# EAGLE design mLRS-tx-module01-v014 (EAGLE 7.5.0)
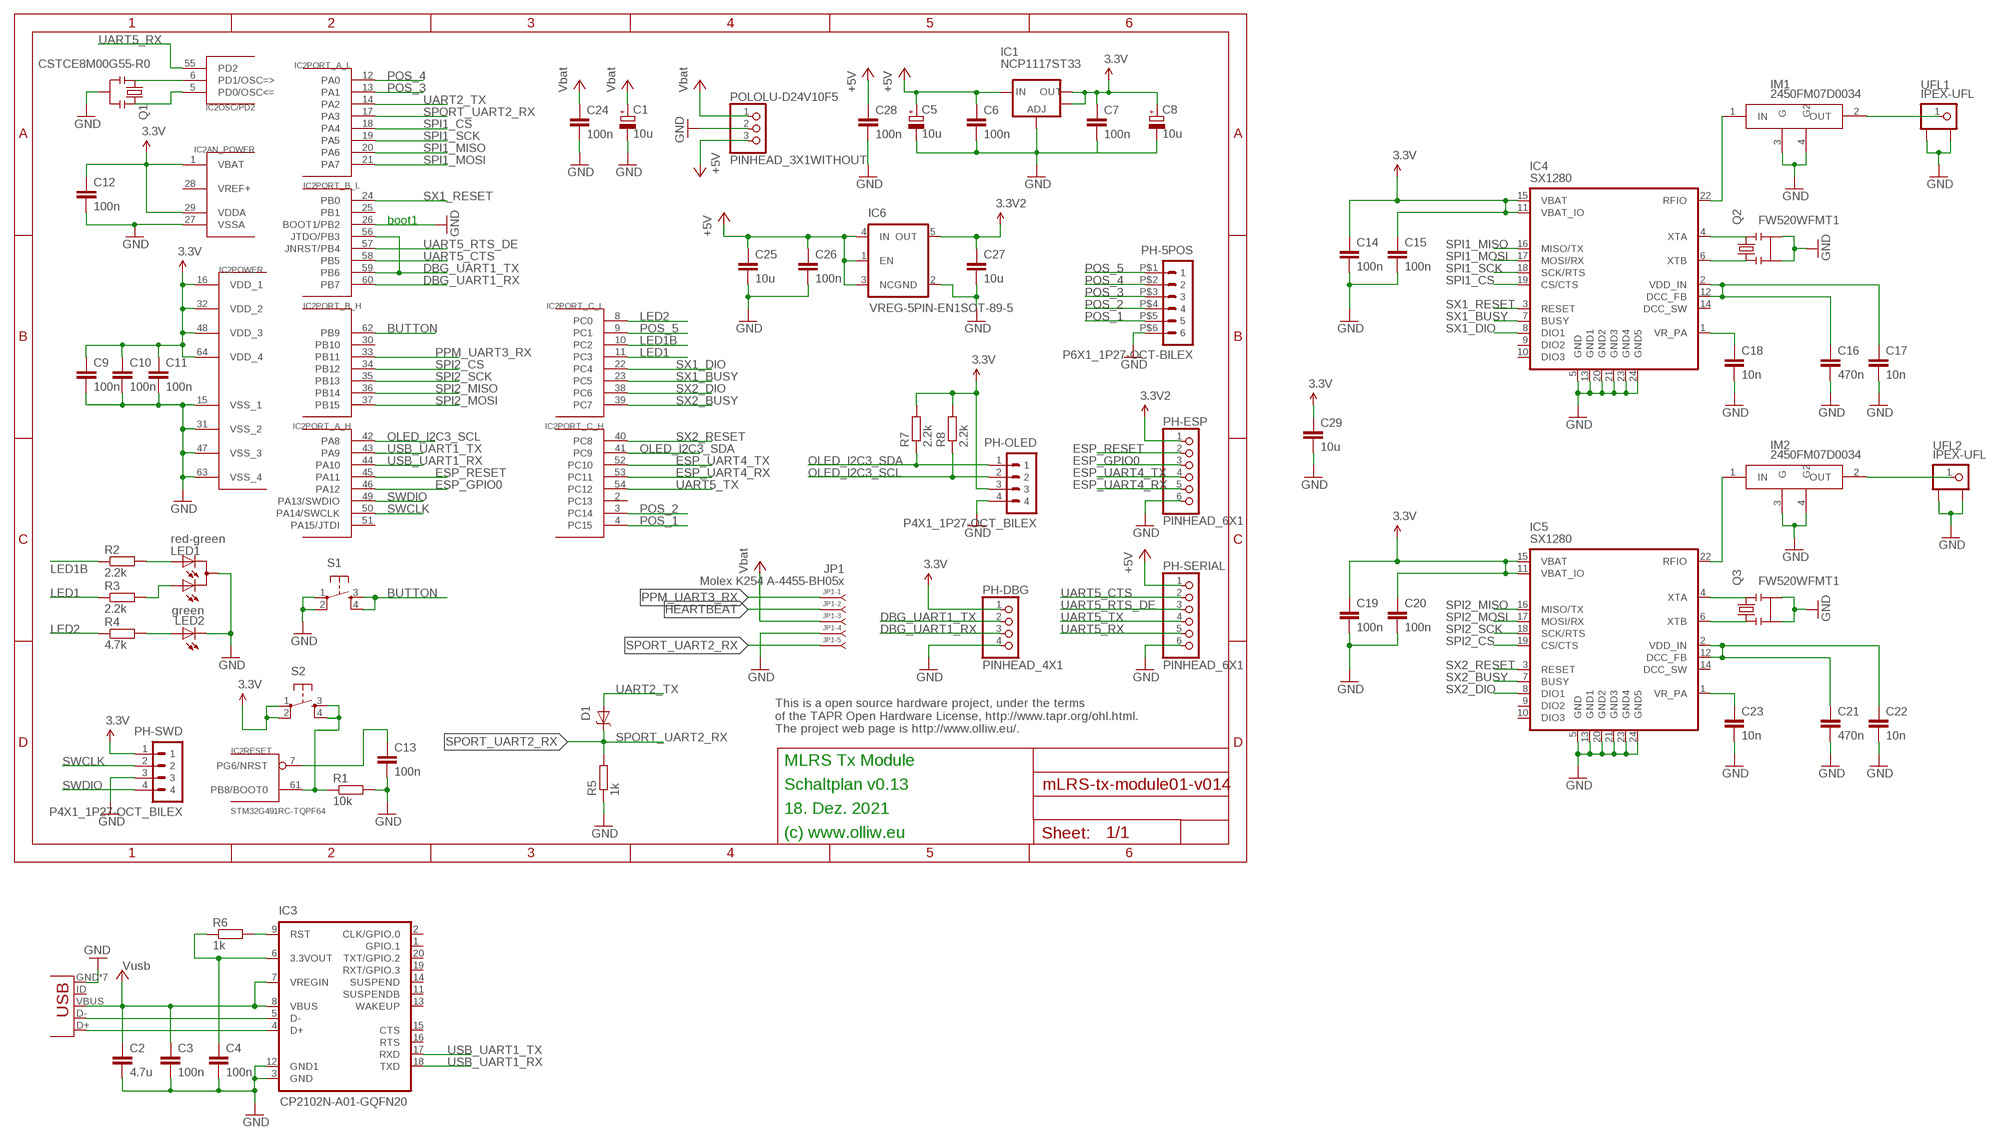
[diagram p0: schematic, sheet 1]

## Parts
C1  10u  CPOL-EUSMCA  [SMC_A]
C2  4.7u  C-EUC0603  [C0603]
C3  100n  C-EUC0402  [C0402]
C4  100n  C-EUC0402  [C0402]
C5  10u  CPOL-EUSMCA  [SMC_A]
C6  100n  C-EUC0603  [C0603]
C7  100n  C-EUC0603  [C0603]
C8  10u  CPOL-EUSMCA  [SMC_A]
C9  100n  C-EUC0603  [C0603]
C10  100n  C-EUC0603  [C0603]
C11  100n  C-EUC0603  [C0603]
C12  100n  C-EUC0603  [C0603]
C13  100n  C-EUC0603  [C0603]
C14  100n  C-EUC0402  [C0402]
C15  100n  C-EUC0402  [C0402]
C16  470n  C-EUC0402  [C0402]
C17  10n  C-EUC0402  [C0402]
C18  10n  C-EUC0402  [C0402]
C19  100n  C-EUC0402  [C0402]
C20  100n  C-EUC0402  [C0402]
C21  470n  C-EUC0402  [C0402]
C22  10n  C-EUC0402  [C0402]
C23  10n  C-EUC0402  [C0402]
C24  100n  C-EUC0603  [C0603]
C25  10u  C-EUC0603  [C0603]
C26  100n  C-EUC0603  [C0603]
C27  10u  C-EUC0603  [C0603]
C28  100n  C-EUC0603  [C0603]
C29  10u  C-EUC0603  [C0603]
D1  PMEG3010ER  DIODE-SCHOTTKYSOD123-W  [SOD123W-DIODE]
IC1  NCP1117ST33  V_REG_LM1117SOT223  [SOT223]
IC2  STM32G491RC-TQPF64  STM32G4X1RX-TQPF64  [TQFP64]
IC3  CP2102N-A01-GQFN20  CP2102N-QFN20  [QFN20-CP2102N]
IC4  SX1280  [QFN24-4X4-SX128X]
IC5  SX1280  [QFN24-4X4-SX128X]
IC6  VREG-5PIN-EN1SOT-89-5  [SOT-89-5]
IM1  2450FM07D0034  SX-IMPEDANCE-MATCH  [SX-IMPEDANCE-MATCH]
IM2  2450FM07D0034  SX-IMPEDANCE-MATCH  [SX-IMPEDANCE-MATCH]
JP1  Molex K254 A-4455-BH05x  4455-B05_S  [4455-B05]
LED1  red-green  LED-DUO-C-TIGHT  [LED-DUO-TIGHT]
LED2  green  LED3MM  [LED3MM]
PH-5POS  P6X1_1P27-OCT-BILEX  [6X1_1P27_OCT_BILEX]
PH-DBG  PINHEAD_4X1  [PINHEAD_4X1]
PH-ESP  PINHEAD_6X1  [PINHEAD_6X1]
PH-OLED  P4X1_1P27-OCT_BILEX  [4X1_1P27_OCT_BILEX]
PH-SERIAL  PINHEAD_6X1  [PINHEAD_6X1]
PH-SWD  P4X1_1P27-OCT_BILEX  [4X1_1P27_OCT_BILEX]
POLOLU-D24V10F5  PINHEAD_3X1WITHOUT  [PINHEAD_3X1_WO]
Q1  CSTCE8M00G55-R0  RESONATORSMD  [RESONATOR-SMD]
Q2  FW520WFMT1  CRYSTAL52MHZ  [CRYSTAL-SMD-2X1P6-GND]
Q3  FW520WFMT1  CRYSTAL52MHZ  [CRYSTAL-SMD-2X1P6-GND]
R1  10k  R-EU_R0402  [R0402]
R2  2.2k  R-EU_R0402  [R0402]
R3  2.2k  R-EU_R0402  [R0402]
R4  4.7k  R-EU_R0402  [R0402]
R5  1k  R-EU_R0402  [R0402]
R6  1k  R-EU_R0402  [R0402]
R7  2.2k  R-EU_R0402  [R0402]
R8  2.2k  R-EU_R0402  [R0402]
S1  TAC_SWITCHPTH  [TACTILE-PTH]
S2  TAC_SWITCHPTH  [TACTILE-PTH]
UFL1  IPEX-UFL  [IPEX-UFL-SMD]
UFL2  IPEX-UFL  [IPEX-UFL-SMD]
USB  USB-MICROB-UP  [USB-MICROB-UP]

## Nets
2.8V: C27.1 IC6.5(OUT) PH-ESP.1 ; supply symbol labelled 3.3V2
3.3V: C7.1 C8.+ C9.1 C10.1 C11.1 C12.1 C14.1 C15.1 C19.1 C20.1 C29.1 IC1.2(OUT) IC1.4(OUT) IC2.1(AN_POWER:VBAT) IC2.16(POWER:VDD_1) IC2.29(AN_POWER:VDDA) IC2.32(POWER:VDD_2) IC2.48(POWER:VDD_3) IC2.64(POWER:VDD_4) IC4.11(VBAT_IO) IC4.15(VBAT) IC5.11(VBAT_IO) IC5.15(VBAT) PH-DBG.1 PH-OLED.3 PH-SWD.1 R7.2 R8.2 S2.1 S2.2
3.3V-CP2102: C4.1 IC3.6(3.3VOUT) R6.1
+5V: C5.+ C6.1 C25.1 C26.1 C28.1 IC1.3(IN) IC6.1(EN) IC6.3(NC) IC6.4(IN) PH-SERIAL.1 POLOLU-D24V10F5.3
BOOT0: IC2.61(RESET:PB8/BOOT0) R1.1 S2.3 S2.4
BUTTON: IC2.62(PORT_B_H:PB9) S1.3 S1.4
DBG_UART1_RX: IC2.60(PORT_B_L:PB7) PH-DBG.3
DBG_UART1_TX: IC2.56(PORT_B_L:JTDO/PB3) IC2.59(PORT_B_L:PB6) PH-DBG.2
ESP_GPIO0: IC2.46(PORT_A_H:PA12) PH-ESP.3
ESP_RESET: IC2.45(PORT_A_H:PA11) PH-ESP.2
ESP_UART4_RX: IC2.53(PORT_C_H:PC11) PH-ESP.5
ESP_UART4_TX: IC2.52(PORT_C_H:PC10) PH-ESP.4
GND: C1.- C2.2 C3.2 C4.2 C5.- C6.2 C7.2 C8.- C9.2 C10.2 C11.2 C12.2 C13.2 C14.2 C15.2 C16.2 C17.2 C18.2 C19.2 C20.2 C21.2 C22.2 C23.2 C24.2 C25.2 C26.2 C27.2 C28.2 C29.2 IC1.1(ADJ) IC2.15(POWER:VSS_1) IC2.26(PORT_B_L:BOOT1/PB2) IC2.27(AN_POWER:VSSA) IC2.31(POWER:VSS_2) IC2.47(POWER:VSS_3) IC2.63(POWER:VSS_4) IC3.3(GND) IC3.12(GND1) IC4.5(GND) IC4.13(GND1) IC4.20(GND2) IC4.21(GND3) IC4.23(GND4) IC4.24(GND5) IC5.5(GND) IC5.13(GND1) IC5.20(GND2) IC5.21(GND3) IC5.23(GND4) IC5.24(GND5) IC6.2(GND) IM1.3(G) IM1.4(G2) IM2.3(G) IM2.4(G2) JP1.4 LED1.K(C) LED2.K(C) PH-5POS.P$6 PH-DBG.4 PH-ESP.6 PH-OLED.4 PH-SERIAL.6 PH-SWD.3 POLOLU-D24V10F5.2 Q1.2 Q2.2 Q2.4 Q3.2 Q3.4 R1.2 R5.1 S1.1 S1.2 UFL1.2 UFL1.3 UFL2.2 UFL2.3 USB.GND USB.P$1(GND) USB.P$2(GND) USB.P$3(GND) USB.P$4(GND) USB.P$5(GND) USB.P$6(GND)
HEARTBEAT: JP1.2
LED1: IC2.11(PORT_C_L:PC3) R3.1
LED1B: IC2.10(PORT_C_L:PC2) R2.1
LED2: IC2.8(PORT_C_L:PC0) R4.1
N$1: IC3.5(D-) USB.D-
N$2: C21.1 C22.1 IC5.2(VDD_IN) IC5.12(DCC_FB)
N$3: IC3.4(D+) USB.D+
N$4: LED1.A2 R2.2
N$5: C13.1 IC2.7(RESET:PG6/NRST)
N$6: C23.1 IC5.1(VR_PA)
N$7: IC5.4(XTA) Q3.3
N$8: LED1.A1 R3.2
N$9: LED2.A R4.2
N$10: IC5.6(XTB) Q3.1
N$11: IC5.22(RFIO) IM2.1(IN)
N$12: IC2.5(OSC/PD2:PD0/OSC<=) Q1.3
N$13: C16.1 C17.1 IC4.2(VDD_IN) IC4.12(DCC_FB)
N$14: IC2.6(OSC/PD2:PD1/OSC=>) Q1.1
N$15: C18.1 IC4.1(VR_PA)
N$16: IC4.4(XTA) Q2.3
N$17: IC4.6(XTB) Q2.1
N$18: IC4.22(RFIO) IM1.1(IN)
N$19: IM1.2(OUT) UFL1.1
N$20: IM2.2(OUT) UFL2.1
N$21: IC3.9(RST) R6.2
OLED_I2C3_SCL: IC2.42(PORT_A_H:PA8) PH-OLED.2 R8.1
OLED_I2C3_SDA: IC2.41(PORT_C_H:PC9) PH-OLED.1 R7.1
POS_1: IC2.4(PORT_C_H:PC15) PH-5POS.P$5
POS_2: IC2.3(PORT_C_H:PC14) PH-5POS.P$4
POS_3: IC2.13(PORT_A_L:PA1) PH-5POS.P$3
POS_4: IC2.12(PORT_A_L:PA0) PH-5POS.P$2
POS_5: IC2.9(PORT_C_L:PC1) PH-5POS.P$1
PPM_UART3_RX: IC2.33(PORT_B_H:PB11) JP1.1
SPI1_CS: IC2.18(PORT_A_L:PA4) IC4.19(CS/CTS)
SPI1_MISO: IC2.20(PORT_A_L:PA6) IC4.16(MISO/TX)
SPI1_MOSI: IC2.21(PORT_A_L:PA7) IC4.17(MOSI/RX)
SPI1_SCK: IC2.19(PORT_A_L:PA5) IC4.18(SCK/RTS)
SPI2_CS: IC2.34(PORT_B_H:PB12) IC5.19(CS/CTS)
SPI2_MISO: IC2.36(PORT_B_H:PB14) IC5.16(MISO/TX)
SPI2_MOSI: IC2.37(PORT_B_H:PB15) IC5.17(MOSI/RX)
SPI2_SCK: IC2.35(PORT_B_H:PB13) IC5.18(SCK/RTS)
SPORT_UART2_RX: D1.C IC2.17(PORT_A_L:PA3) JP1.5 R5.2
SWCLK: IC2.50(PORT_A_H:PA14/SWCLK) PH-SWD.2
SWDIO: IC2.49(PORT_A_H:PA13/SWDIO) PH-SWD.4
SX1_BUSY: IC2.23(PORT_C_L:PC5) IC4.7(BUSY)
SX1_DIO: IC2.22(PORT_C_L:PC4) IC4.8(DIO1)
SX1_RESET: IC2.24(PORT_B_L:PB0) IC4.3(RESET)
SX2_BUSY: IC2.39(PORT_C_L:PC7) IC5.7(BUSY)
SX2_DIO: IC2.38(PORT_C_L:PC6) IC5.8(DIO1)
SX2_RESET: IC2.40(PORT_C_H:PC8) IC5.3(RESET)
UART2_TX: D1.A IC2.14(PORT_A_L:PA2)
UART5_CTS: IC2.58(PORT_B_L:PB5) PH-SERIAL.2
UART5_RTS_DE: IC2.57(PORT_B_L:JNRST/PB4) PH-SERIAL.3
UART5_RX: IC2.55(OSC/PD2:PD2) PH-SERIAL.5
UART5_TX: IC2.54(PORT_C_H:PC12) PH-SERIAL.4
USB_UART1_RX: IC2.44(PORT_A_H:PA10) IC3.18(TXD)
USB_UART1_TX: IC2.43(PORT_A_H:PA9) IC3.17(RXD)
VCC: C1.+ C24.1 JP1.3 POLOLU-D24V10F5.1 ; supply symbol labelled Vbat
VUSB: C2.1 C3.1 IC3.7(VREGIN) IC3.8(VBUS) USB.VBUS ; supply symbol labelled Vusb
Unconnected: IC2.2(PORT_C_H:PC13) IC2.25(PORT_B_L:PB1) IC2.28(AN_POWER:VREF+) IC2.30(PORT_B_H:PB10) IC2.51(PORT_A_H:PA15/JTDI) IC3.1(GPIO.1) IC3.2(CLK/GPIO.0) IC3.11(SUSPENDB) IC3.13(WAKEUP) IC3.14(SUSPEND) IC3.15(CTS) IC3.16(RTS) IC3.19(RXT/GPIO.3) IC3.20(TXT/GPIO.2) IC4.9(DIO2) IC4.10(DIO3) IC4.14(DCC_SW) IC5.9(DIO2) IC5.10(DIO3) IC5.14(DCC_SW) USB.ID

## Notes on the sheet
- boot1
- This is a open source hardware project, under the terms
  of the TAPR Open Hardware License, http://www.tapr.org/ohl.html.
  The project web page is http://www.olliw.eu/.
- MLRS Tx Module
- Schaltplan v0.13
- 18. Dez. 2021
- (c) www.olliw.eu

## Library data of the parts
C1 C5 C8 = rcl:CPOL-EU: POLARIZED CAPACITOR, European symbol
C2-C4 C6 C7 C9-C29 = rcl:C-EU: CAPACITOR, European symbol
D1 = # stdlib:DIODE-SCHOTTKY
IC1 = # SparkFun2:V_REG_LM1117: Voltage Regulator LM1117 Standard adjustable voltage regulator but in SMD form. Spark Fun Electronics SKU : COM-00595
IC2 = # stm32:STM32G4X1RX
IC3 = # stdlib:CP2102N-QFN20
IC4 IC5 = # stdlib:SX1280
IC6 = # stdlib:VREG-5PIN-EN1
IM1 IM2 = # stdlib:SX-IMPEDANCE-MATCH
JP1 = con-molex-kk:4455-B05_S: RECEPTACAL
LED1 = # stdlib:LED-DUO-C
LED2 = led:LED: LED OSRAM: - CHIPLED LG R971, LG N971, LY N971, LG Q971, LY Q971, LO R971, LY R971 LH N974, LH R974 LS Q976, LO Q976, LY Q976 LO Q996 - Hyper CHIPLED LW Q18S LB Q993, LB Q99A, LB R99A - SideLED LS A670, LO A670, LY A670, LG A670, LP A670 LB A673, LV A673, LT A673, LW A673 LH A674 LY A675 LS A676, LA A676, LO A676, LY A676, LW A676 LS A679, LY A679, LG A679 - Hyper Micro SIDELED® LS Y876, LA Y876, LO Y876, LY Y876 LT Y87S - SmartLED LW L88C, LW L88S LB L89C, LB L89S, LG L890 LS L89K, LO L89K, LY L89K LS L896, LA L896, LO L896, LY L896 - TOPLED LS T670, LO T670, LY T670, LG T670, LP T670 LSG T670, LSP T670, LSY T670, LOP T670, LYG T670 LG T671, LOG T671, LSG T671 LB T673, LV T673, LT T673, LW T673 LH T674 LS T676, LA T676, LO T676, LY T676, LB T676, LH T676, LSB T676, LW T676 LB T67C, LV T67C, LT T67C, LS T67K, LO T67K, LY T67K, LW E67C LS E67B, LA E67B, LO E67B, LY E67B, LB E67C, LV E67C, LT E67C LW T67C LS T679, LY T679, LG T679 LS T770, LO T770, LY T770, LG T770, LP T770 LB T773, LV T773, LT T773, LW T773 LH T774 LS E675, LA E675, LY E675, LS T675 LS T776, LA T776, LO T776, LY T776, LB T776 LHGB T686 LT T68C, LB T68C - Hyper Mini TOPLED® LB M676 - Mini TOPLED Santana® LG M470 LS M47K, LO M47K, LY M47K Source: http://www.osram.convergy.de LUXEON: - LUMILED® LXK2-PW12-R00, LXK2-PW12-S00, LXK2-PW14-U00, LXK2-PW14-V00 LXK2-PM12-R00, LXK2-PM12-S00, LXK2-PM14-U00 LXK2-PE12-Q00, LXK2-PE12-R00, LXK2-PE12-S00, LXK2-PE14-T00, LXK2-PE14-U00 LXK2-PB12-K00, LXK2-PB12-L00, LXK2-PB12-M00, LXK2-PB14-N00, LXK2-PB14-P00, LXK2-PB14-Q00 LXK2-PR12-L00, LXK2-PR12-M00, LXK2-PR14-Q00, LXK2-PR14-R00 LXK2-PD12-Q00, LXK2-PD12-R00, LXK2-PD12-S00 LXK2-PH12-R00, LXK2-PH12-S00 LXK2-PL12-P00, LXK2-PL12-Q00, LXK2-PL12-R00 Source: www.luxeon.com KINGBRIGHT: KA-3528ASYC Source: www.kingbright.com
PH-5POS = # stdlib:P6X1_1P27: PinHead 6x1 1.27mm - QUAD 1.0x0.5 - QUAD 1.0x0.6 - LONG 1.0x0.5 - LONG 1.0x0.6
PH-DBG = # stdlib:PINHEAD_4X1
PH-ESP PH-SERIAL = # stdlib:PINHEAD_6X1
PH-OLED PH-SWD = # stdlib:P4X1_1P27
POLOLU-D24V10F5 = # stdlib:PINHEAD_3X1
Q1 = # SparkFun2:RESONATOR: Resonator Small SMD resonator. This is the itty bitty 10/20MHz resonators with built in caps. CSTCE10M0G55 and CSTCE20M0V53. Footprint has been reviewed closely but hasn't been tested yet.
Q2 Q3 = # stdlib:CRYSTAL52MHZ
R1-R8 = rcl:R-EU_: RESISTOR, European symbol
S1 S2 = # SparkFun2:TAC_SWITCH: Momentary Switch Button commonly used for reset or general input. Spark Fun Electronics SKU : COM-00097
UFL1 UFL2 = # stdlib:IPEX-UFL
USB = # stdlib:USB-MICROB

## Board
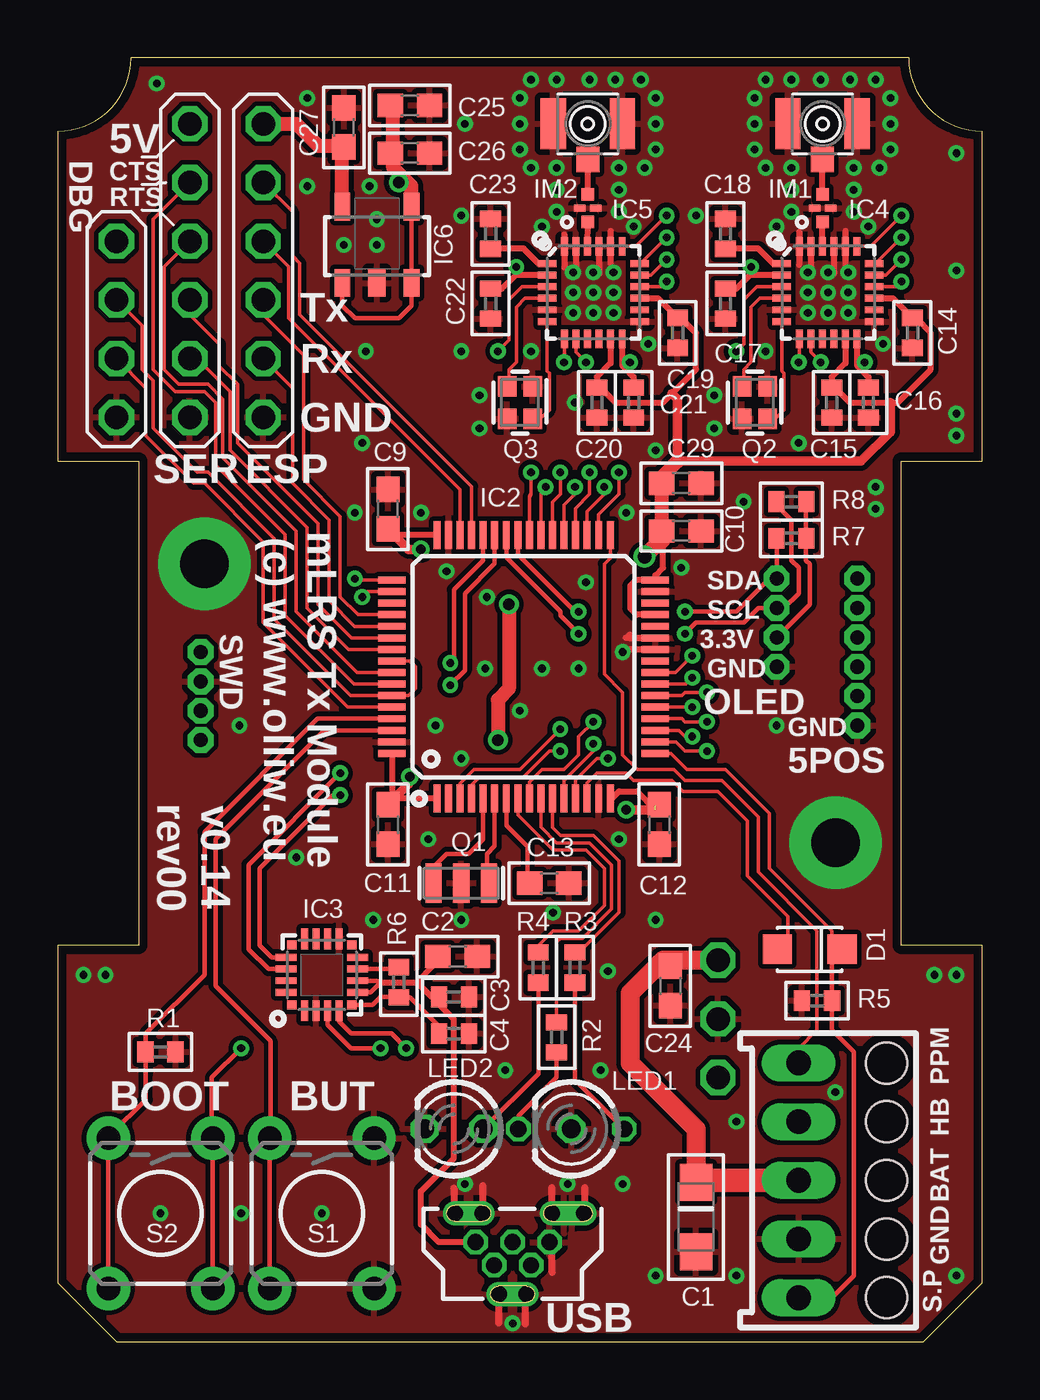
[diagram p1: board, top side]
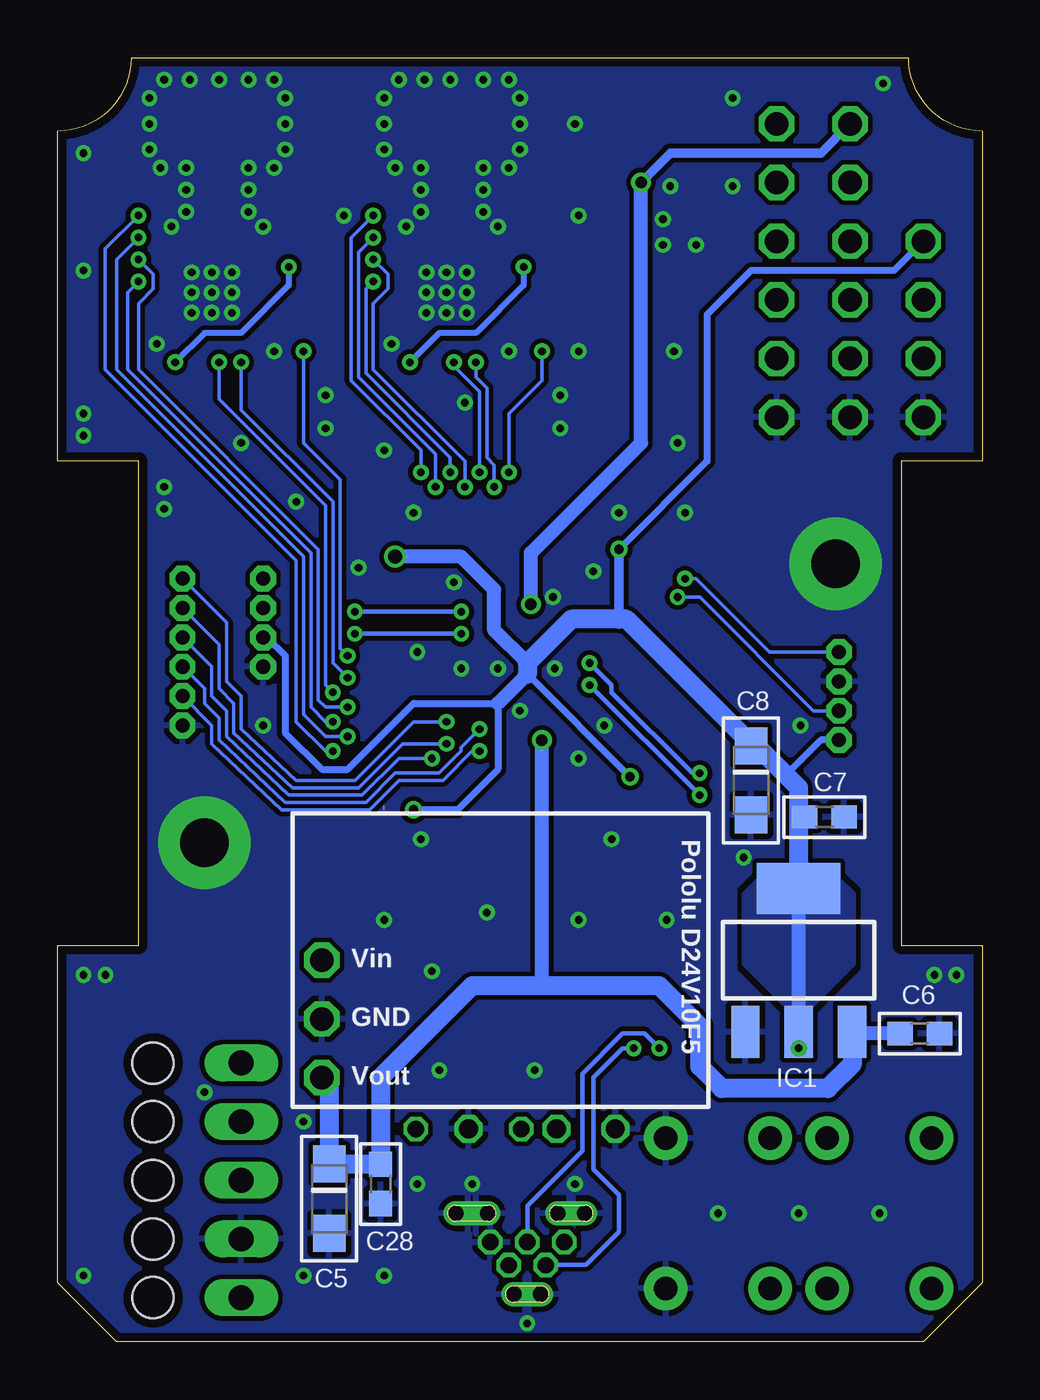
[diagram p2: board, bottom side, seen from below]

Size 40.01 x 55.56 mm. Coordinates in mm from the lower left corner, seen from the top.
Outline: 2.54,0 37.47,0 40.01,2.54 40.01,17.14 36.51,17.14 36.51,38.1 40.01,38.1 40.01,52.39 arc-90 36.83,55.56 3.17,55.56 arc-90 0,52.39 0,38.1 3.49,38.1 3.49,17.14 0,17.14 0,2.54 2.54,0
Copper layers (1*16): Top 0.0356mm / dielectric 1.5011mm / Bottom 0.0356mm
Design rules "ow-oshpark-2layer": minimum track width 6mil, minimum drill 13mil, track to track 6mil, track to pad 6mil, pad to pad 6mil, via to via 6mil, smd to smd 6mil, copper to edge 15mil, drill to drill 6mil, minimum pad ring 7mil, minimum via ring 7mil, stop-mask expansion 2.5mil, vias tented up to drill 26mil, thermal gap 10mil

### Footprints (pad centres in the part's own frame; a part is rotated, then mirrored left to right if it is on the bottom)
SMC_A = smd 1.6 x 1.4: + -1.5,0; - 1.5,0
C0603 = smd 1.1 x 1: 1 -0.85,0; 2 0.85,0
C0402 = smd 0.7 x 0.9: 1 -0.65,0; 2 0.65,0
SOD123W-DIODE = smd 1.27 x 1.27: A -1.4,0; C 1.4,0
SOT223 = smd 1.219 x 2.235: 1 -2.311,-3.099; 2 0,-3.099; 3 2.311,-3.099 | smd 3.6 x 2.2: 4 0,3.099
TQFP64 = smd 1.2 x 0.3: 1 -5.7,3.75; 2 -5.7,3.25; 3 -5.7,2.75; 4 -5.7,2.25; 5 -5.7,1.75; 6 -5.7,1.25; 7 -5.7,0.75; 8 -5.7,0.25; 9 -5.7,-0.25; 10 -5.7,-0.75; 11 -5.7,-1.25; 12 -5.7,-1.75; 13 -5.7,-2.25; 14 -5.7,-2.75; 15 -5.7,-3.25; 16 -5.7,-3.75; 33 5.7,-3.75; 34 5.7,-3.25; 35 5.7,-2.75; 36 5.7,-2.25; 37 5.7,-1.75; 38 5.7,-1.25; 39 5.7,-0.75; 40 5.7,-0.25; 41 5.7,0.25; 42 5.7,0.75; 43 5.7,1.25; 44 5.7,1.75; 45 5.7,2.25; 46 5.7,2.75; 47 5.7,3.25; 48 5.7,3.75 | smd 0.3 x 1.2: 17 -3.75,-5.7; 18 -3.25,-5.7; 19 -2.75,-5.7; 20 -2.25,-5.7; 21 -1.75,-5.7; 22 -1.25,-5.7; 23 -0.75,-5.7; 24 -0.25,-5.7; 25 0.25,-5.7; 26 0.75,-5.7; 27 1.25,-5.7; 28 1.75,-5.7; 29 2.25,-5.7; 30 2.75,-5.7; 31 3.25,-5.7; 32 3.75,-5.7; 49 3.75,5.7; 50 3.25,5.7; 51 2.75,5.7; 52 2.25,5.7; 53 1.75,5.7; 54 1.25,5.7; 55 0.75,5.7; 56 0.25,5.7; 57 -0.25,5.7; 58 -0.75,5.7; 59 -1.25,5.7; 60 -1.75,5.7; 61 -2.25,5.7; 62 -2.75,5.7; 63 -3.25,5.7; 64 -3.75,5.7
QFN20-CP2102N = smd 0.4 x 0.4: 1 -1.3,1.3; 6 -1.3,-1.3; 11 1.3,-1.3; 16 1.3,1.3 | smd 0.9 x 0.3: 2 -1.55,0.75; 3 -1.55,0.25; 4 -1.55,-0.25; 5 -1.55,-0.75; 12 1.55,-0.75; 13 1.55,-0.25; 14 1.55,0.25; 15 1.55,0.75 | smd 0.3 x 0.9: 7 -0.75,-1.55; 8 -0.25,-1.55; 9 0.25,-1.55; 10 0.75,-1.55; 17 0.75,1.55; 18 0.25,1.55; 19 -0.25,1.55; 20 -0.75,1.55
QFN24-4X4-SX128X = smd 0.8 x 0.3: 1 -2,1.25; 2 -2,0.75; 3 -2,0.25; 4 -2,-0.25; 5 -2,-0.75; 6 -2,-1.25; 13 2,-1.25; 14 2,-0.75; 15 2,-0.25; 16 2,0.25; 17 2,0.75; 18 2,1.25 | smd 0.3 x 0.8: 7 -1.25,-2; 8 -0.75,-2; 9 -0.25,-2; 10 0.25,-2; 11 0.75,-2; 12 1.25,-2; 19 1.25,2; 20 0.75,2; 21 0.25,2; 22 -0.25,2; 23 -0.75,2; 24 -1.25,2
SOT-89-5 = smd 0.68 x 1.2: 1 -1.5,-1.65; 3 1.5,-1.65; 4 1.5,1.65; 5 -1.5,1.65 | smd 0.76 x 1.2: 2 0,-1.65
SX-IMPEDANCE-MATCH = smd 0.55 x 0.55: 1 -0.6,0; 2 0.6,0 | smd 0.3 x 0.5: 3 0,-0.35; 4 0,0.35
4455-B05 = drill 1.067 long: 1 -5.08,0; 2 -2.54,0; 3 0,0; 4 2.54,0; 5 5.08,0 | hole 1.778: -5.08,3.81; -2.54,3.81; 0,3.81; 2.54,3.81; 5.08,3.81
LED-DUO-TIGHT = drill 0.711 pad 1.067 octagon: A1 -2.286,0; A2 2.286,0 | drill 0.813 octagon: K 0,0
LED3MM = drill 0.813 octagon: A -1.27,0; K 1.27,0
6X1_1P27_OCT_BILEX = drill 0.61 pad 1.118 octagon: P$1 0,0; P$2 0,-1.27; P$3 0,-2.54; P$4 0,-3.81; P$5 0,-5.08; P$6 0,-6.35
PINHEAD_4X1 = drill 1.016 octagon: 1 0,7.62; 2 0,5.08; 3 0,2.54; 4 0,0
PINHEAD_6X1 = drill 1.016 octagon: 1 0,0; 2 0,-2.54; 3 0,-5.08; 4 0,-7.62; 5 0,-10.16; 6 0,-12.7
4X1_1P27_OCT_BILEX = drill 0.61 pad 1.118 octagon: 1 0,0; 2 0,-1.27; 3 0,-2.54; 4 0,-3.81
PINHEAD_3X1_WO = drill 1.016 octagon: 1 0,0; 2 0,-2.54; 3 0,-5.08
RESONATOR-SMD = smd 0.7 x 1.7: 1 -1.2,0; 2 0,0; 3 1.2,0
CRYSTAL-SMD-2X1P6-GND = smd 0.9 x 0.8: 1 -0.7,-0.55; 2 0.7,-0.55; 3 0.7,0.55; 4 -0.7,0.55
R0402 = smd 0.7 x 0.9: 1 -0.65,0; 2 0.65,0
TACTILE-PTH = drill 1.016 pad 1.88: 1 -3.251,2.261; 2 3.251,2.261; 3 -3.251,-2.261; 4 3.251,-2.261
IPEX-UFL-SMD = smd 1 x 1.1: 1 0,-1.55 | smd 1.1 x 2.2: 2 -1.5,0; 3 1.5,0
USB-MICROB-UP = drill 0.7 pad 1 octagon: D+ -0.5,0; D- 0.5,-0.8; GND -0.5,1.6; ID 0.5,0.8; VBUS -0.5,-1.6 | drill 0.7 pad 1 offset: P$1 -1.75,1.7; P$2 1.75,0.6; P$3 -1.75,3.1; P$4 1.75,-0.6; P$5 -1.75,-2.5; P$6 -1.75,-1.3

### Placement (x,y rotation side)
C1  27.62,5.4 270 top
C2  17.3,16.67 0 top
C3  17.14,14.92 0 top
C4  17.14,13.34 0 top
C5  28.26,6.19 270 bottom
C6  2.7,13.34 0 bottom
C7  6.83,22.7 0 bottom
C8  10,24.29 270 bottom
C9  14.29,36.04 90 top
C10  26.99,35.08 0 top
C11  14.29,22.38 270 top
C12  26.04,22.38 270 top
C13  21.27,19.84 0 top
C14  36.99,43.66 270 top
C15  33.5,40.64 270 top
C16  35.08,40.64 270 top
C17  28.89,44.93 270 top
C18  28.89,47.94 90 top
C19  26.83,43.66 270 top
C20  23.34,40.64 270 top
C21  24.92,40.64 270 top
C22  18.73,44.93 270 top
C23  18.73,47.94 90 top
C24  26.51,15.4 270 top
C25  15.24,53.5 0 top
C26  15.24,51.44 0 top
C27  12.38,52.55 90 top
C28  26.04,6.83 270 bottom
C29  26.99,37.15 0 top
D1  32.54,16.99 0 top
IC1  7.94,16.51 0 bottom
IC2  20.16,29.21 90 top
IC3  11.43,15.88 90 top
IC4  33.34,45.4 0 top
IC5  23.18,45.4 0 top
IC6  13.81,47.47 0 top
IM1  33.1,49.05 90 top
IM2  22.94,49.05 90 top
JP1  32.07,6.99 270 top
LED1  22.22,9.21 180 top
LED2  17.14,9.21 180 top
PH-5POS  34.61,33.02 0 top
PH-DBG  2.54,40.01 0 top
PH-ESP  8.89,52.7 0 top
PH-OLED  31.11,33.02 0 top
PH-SERIAL  5.71,52.7 0 top
PH-SWD  6.19,26.04 180 top
POLOLU-D24V10F5  28.57,16.51 0 top
Q1  17.46,19.84 180 top
Q2  30.16,40.64 90 top
Q3  20,40.64 90 top
R1  4.45,12.54 0 top
R2  21.59,13.18 270 top
R3  22.38,16.19 270 top
R4  20.8,16.19 270 top
R5  32.86,14.76 0 top
R6  14.76,15.56 90 top
R7  31.75,34.77 0 top
R8  31.75,36.35 0 top
S1  11.43,5.56 270 top
S2  4.45,5.56 270 top
UFL1  33.1,52.7 0 top
UFL2  22.94,52.7 0 top
USB  19.68,3.81 270 top

### Tracks (layer width: path | path; a pad name or v marks a point on that pad's centre or on a via)
2.8V
  Top 0.61: IC6.5 12.31,51.52 12.22,51.75 | 12.22,51.75 C27.1 12.33,51.75 12.22,51.75 | PH-ESP.1 10.32,52.7 11.27,51.75 12.22,51.75
3.3V  (via drill 0.33, 0.4, 0.6)  (1 unrouted)
  Top 0.152: 32.39,36.34 R8.2 | R7.2 32.39,34.92
  Top 0.203: S2.2 S2.1 6.67,8.85 6.67,11.43 v7.94,12.7 | 14.46,23.73 C11.1 14.25,23.51 | 14.4,34.91 C9.1 | 25.86,35.04 C10.1 | PH-OLED.3 32.54,31.91 32.54,33.66 32.39,33.81 32.39,34.92 32.39,36.34
  Top 0.254: IC4.15 36.14,45.15 C14.1 37,44.29 37.15,44.29 37.78,43.66 37.78,42.07 36.35,40.64 36.04,40.64 34.29,40.64 33.64,41.29 C15.1 33.5,41.75 34.09,42.34 IC4.11 | IC5.15 25.98,45.15 C19.1 27,44.13 27.15,44.13 27.62,43.66 27.62,42.07 26.59,41.04 26.19,40.64 24.13,40.64 23.48,41.29 C20.1 23.34,41.75 23.93,42.34 IC5.11 | IC2.64 14.46,23.73 | IC2.1 14.25,23.51 | IC2.48 14.4,34.91 | IC2.29 25.05,31.46 24.76,31.75 24.76,32.7 25.02,32.96 IC2.32 25.86,33.16 26.19,33.5 26.19,34.66 26.19,34.87 C10.1 | v25.4,33.97 25.4,34.29 26.19,35.08 | IC2.16 23.99,23.51 24.29,23.81 25.08,23.81 25.88,23.02 26.25,23.02 C12.1 | 25.88,23.18 25.88,23.23
  Top 0.406: v15.72,34.29 15.18,34.29 C9.1 | 26.59,41.04 26.83,40.8 26.83,38.1 34.77,38.1 36.04,39.37 36.04,40.64 | v15.24,24.45 15.18,24.13 C11.1 | v24.61,23.02 25.66,23.02 C12.1
  Top 0.61: 26.83,38.1 26.14,37.41 C29.1 C10.1 26.19,35.08 26.19,34.66 v25.4,33.97
  Bottom 0.203: IC1.2 v7.94,12.7
  Bottom 0.254: PH-OLED.3 30.96,30.48
  Bottom 0.305: PH-SWD.1 6.99,26.04 8.41,24.61 8.41,24.45 | v24.61,23.02 22.7,23.02 20.95,24.77 20.95,27.62 24.61,27.62 27.46,24.77 28.57,24.77 30.16,26.35 30.16,29.69 30.96,30.48 | 19.68,28.89 v15.24,24.45 | PH-DBG.1 3.81,46.35 10,46.35 11.91,44.45 11.91,38.1 v15.72,34.29
  Bottom 0.406: v15.72,34.29 15.72,31.27
  Bottom 0.61: IC1.2 IC1.4 | 10.09,25.72 C8.+ 10.07,25.95 | C7.1 7.94,22.7 | 19.68,29.37 21.11,30.8 21.11,32.54 22.54,33.97 v25.4,33.97 | 19.68,28.89 20.95,27.62
  Bottom 0.813: IC1.4 7.94,22.7 7.94,23.97 8.41,24.45 9.84,25.88 10.09,25.72 | 10.07,25.95 15.4,31.27 15.72,31.27 17.78,31.27 19.68,29.37 19.68,28.89
  pour Bottom (no thermals): 9.68,20 6.19,20 5.56,19.37 5.56,16.35 7.46,14.45 8.41,14.45 10.32,16.35 10.32,19.37
3.3V-CP2102
  Top 0.203: IC3.6 13.62,14.57 13.97,14.92 14.75,14.92 R6.1 15.26,14.91 15.56,14.61 15.72,14.43 16.49,13.65 16.51,13.49 16.49,13.48 C4.1
+5V  (via drill 0.5)
  Top 0.203: C26.1 14.52,50.8 | IC6.1 12.31,44.84 12.86,44.29 14.76,44.29 15.31,44.84 IC6.3 IC6.4
  Top 0.254: 14.52,51.47 C26.1
  Top 0.61: v19.53,31.91 19.53,28.26 19.05,27.78 v19.05,26.04 | IC6.4 15.31,50.01 | 15.31,50.01 14.52,50.8 14.52,51.47 14.52,53.37 C25.1 | v14.76,50.16 15.31,50.01
  Bottom 0.406: PH-SERIAL.1 6.99,51.44 13.49,51.44 v14.76,50.16
  Bottom 0.61: C6.1 5.55,13.34 IC1.3 | 19.05,15.56 v19.05,26.04 | v19.53,31.91 19.53,34.13 14.76,38.89 v14.76,50.16
  Bottom 0.813: IC1.3 5.63,11.99 6.67,10.95 11.27,10.95 12.22,11.91 12.22,13.65 13.97,15.4 18.89,15.4 | 18.89,15.4 22.07,15.4 26.04,11.43 C28.1 28.24,7.68 C5.+ 28.26,11.11 POLOLU-D24V10F5.3 | 19.05,15.56 18.89,15.4
BOOT0
  Top 0.152: 2.3,8.81 S2.3
  Top 0.203: IC2.61 11.24,26.96 6.35,22.07 6.35,15.88 3.81,13.34 3.81,11.6 R1.1 3.81,11.57 3.81,10.48 2.3,8.97 2.3,8.81 2.18,8.69 S2.4
BUTTON
  Top 0.203: S1.4 S1.3 9.21,8.85 9.21,13.02 6.83,15.4 6.83,21.75 11.54,26.46 IC2.62
DBG_UART1_RX
  Top 0.152: PH-DBG.3 3.81,41.27 3.81,39.21 5.87,37.15 6.35,37.15 8.89,34.61 8.89,31.11 12.54,27.46 IC2.60
DBG_UART1_TX
  Top 0.152: PH-DBG.2 3.65,43.97 3.65,42.07 4.13,41.59 4.13,39.53 6.03,37.62 6.51,37.62 9.37,34.77 9.37,31.27 12.68,27.96 IC2.59 15.18,27.96 15.48,28.26 15.48,29.21 15.23,29.46 IC2.56
ESP_GPIO0
  Top 0.152: PH-ESP.3 10,46.51 10,44.29 17.41,36.88 IC2.46
ESP_RESET
  Top 0.152: PH-ESP.2 10.16,48.9 10.16,46.99 10.48,46.67 10.48,44.45 17.91,37.02 IC2.45
ESP_UART4_RX
  Top 0.152: PH-ESP.5 10.16,41.27 10.16,37.15 11.75,35.56 11.75,32.07 12.86,30.96 IC2.53
ESP_UART4_TX
  Top 0.152: PH-ESP.4 8.89,44.45 10.64,42.7 10.64,37.31 12.22,35.72 12.22,32.23 12.99,31.46 IC2.52
GND  (via drill 0.33, 2.1 pad 4)
  Top 0.152: 33.59,47.64 IC4.21 | v34.21,46.28 34.29,46.43 34.09,46.63 | 23.43,47.63 IC5.21 | v24.05,46.28 24.13,46.44 23.93,46.64
  Top 0.203: 24.59,30.46 24.76,30.64
  Top 0.254: IC2.27 24.59,30.46 | 22.43,47.64 22.43,46.21 | 21.93,47.92 21.93,46.5 | 23.43,47.63 23.43,46.2 | 23.93,48.07 23.93,46.64 | 32.09,48.03 32.09,46.6 | 32.59,47.64 32.59,46.21 | 33.59,47.64 33.59,46.21 | 34.09,48.06 34.09,46.63 | 24.72,30.46 26.15,30.46 | 26.01,29.96 24.74,29.96
  Top 0.305: 17.14,6.65 17.14,5.37 | 18.39,6.75 18.39,5.47 | 21.37,6.67 21.37,5.39 | 22.81,6.67 22.81,5.39 | 19.08,2.09 19.08,0.82 | 20.23,2.05 20.23,0.77 | 21.39,3 21.39,4.27
  other vias: 38.89,2.86 33.66,21.59 6.35,33.66 23.18,45.4 23.18,46.28 22.3,46.28 22.3,45.4 22.3,44.53 23.18,44.53 24.05,44.53 24.05,45.4 20.48,42.86 25.56,43.18 30.64,42.86 35.72,43.18 33.34,45.4 32.46,45.4 32.46,46.28 33.34,46.28 32.46,44.53 33.34,44.53 34.21,44.53 34.21,45.4 17.62,6.83 21.59,54.61 24.13,54.61 23.02,54.61 20.48,54.61 25.24,54.61 25.88,53.82 25.88,52.7 25.88,51.59 20,53.82 20,52.7 20,51.59 21.59,50.8 21.59,49.85 21.59,48.9 20.95,48.26 24.29,50.8 24.29,49.85 24.29,48.9 24.92,48.26 20.48,50.8 25.4,50.8 31.75,54.61 34.29,54.61 33.02,54.61 35.4,54.61 36.04,52.7 36.04,53.82 36.04,51.59 35.56,50.8 34.45,50.8 34.45,49.85 34.45,48.9 35.08,48.26 31.75,50.8 30.64,50.8 30.16,51.59 30.16,52.7 30.16,53.82 30.64,54.61 31.75,49.85 31.75,48.9 31.11,48.26 38.89,15.88 1.11,15.88 4.45,5.56 22.07,6.83 19.68,0.79 24.29,21.75 17.46,25.24 20,27.3 20.95,29.13 18.49,29.13 18.57,32.23 16.83,33.34 22.86,32.86 24.45,29.84 26.99,33.5 25.88,38.58 18.26,39.53 15.72,35.88 13.81,47.47 17.46,42.86 28.42,40.96 38.89,39.21 38.89,51.44 4.29,54.45 35.4,36.99 13.34,42.86 13.18,38.89 10.32,20.95 11.43,5.56 7.94,5.56 7.86,26.67 32.07,38.89 12.38,47.47 13.49,50.01 13.81,48.58 29.69,36.35 35.4,36.04 38.89,40.16 38.89,46.35 28.42,39.53 18.26,40.96 17.46,48.74 27.62,48.74 22.38,40.64 16.35,26.67 22.54,29.13 24.61,35.88 12.86,35.88 31.11,26.67 16.03,21.75 13.65,18.26 21.43,18.57 25.88,18.26 2.06,15.88 37.94,15.88 19.37,11.75 25.88,2.86 24.45,6.83 23.81,16.03 23.49,11.75 29.37,9.53 29.37,2.86 33.66,10.79 17.46,18.26 10.79,53.82 17.62,52.7 10.79,50.01
  pour Bottom (isolate 0.203, rank 6): -0.64,56.2 40.64,56.2 40.64,-0.64 -0.64,-0.64
  pour Top (isolate 0.203, rank 6): -0.64,56.2 40.64,56.2 40.64,-0.64 -0.64,-0.64
LED1
  Top 0.152: IC2.11 21.41,22.25 21.75,21.91 23.18,21.91 24.29,20.8 24.29,18.57 22.38,16.67 R3.1
LED1B
  Top 0.152: IC2.10 20.91,22.27 21.59,21.59 23.02,21.59 23.97,20.64 23.97,18.73 22.7,17.46 21.75,17.46 21.59,17.3 R2.1
LED2
  Top 0.152: IC2.8 19.91,22.79 21.43,21.27 22.86,21.27 23.65,20.48 23.65,18.89 22.54,17.78 21.43,17.78 20.8,17.14 R4.1
N$1  (via drill 0.33)
  Top 0.203: IC3.5 12.18,13.86 12.7,13.34 14.45,13.34 v15.08,12.7
  Bottom 0.203: v15.08,12.7 15.56,12.7 16.83,11.43 16.83,7.46 15.72,6.35 15.72,4.76 17.14,3.33 18.86,3.33 USB.D-
N$2  (via drill 0.33)
  Top 0.254: 19.8,46.15 19.21,45.56 18.75,45.56 C22.1 | IC5.12 24.43,42.25 24.53,42.15 | 24.53,42.15 24.92,41.75 C21.1 | v24.76,42.39 24.53,42.15 | IC5.2 19.8,46.15 | v19.84,46.51 19.84,46.2 19.8,46.15
  Bottom 0.254: v19.84,46.51 19.84,45.72 21.91,43.66 23.49,43.66 v24.76,42.39
N$3  (via drill 0.33)
  Top 0.203: IC3.4 11.68,13.72 12.7,12.7 v13.97,12.7
  Bottom 0.203: USB.D+ 19.68,5.87 17.3,8.26 17.3,11.59 15.56,13.34 14.61,13.34 v13.97,12.7
N$4
  Top 0.203: R2.2 21.59,11.43 19.94,9.78 LED1.A2
N$5
  Top 0.203: IC2.7 19.41,22.34 20.32,21.43 20.32,19.9 C13.1
N$6
  Top 0.254: IC5.1 20.82,46.65 20.16,47.31 18.75,47.31 C23.1
N$7
  Top 0.152: IC5.4 20.23,45.15 19.84,44.77 19.84,42.39 19.53,42.07 19.53,41.41 Q3.3
N$8
  Top 0.203: R3.2 22.38,11.34 LED1.A1
N$9
  Top 0.203: R4.2 20.8,11.59 LED2.A
N$10
  Top 0.152: IC5.6 21.18,42.01 21.27,41.91 21.27,40.32 20.95,40.01 20.62,40.01 Q3.1
N$11
  Top 0.254: IC5.22 IM2.1
N$12
  Top 0.203: IC2.5 18.41,21.75 17.78,21.11 16.83,21.11 16.35,20.64 16.35,19.93 Q1.3
N$13  (via drill 0.33)
  Top 0.254: IC4.2 29.96,46.15 | 29.96,46.15 29.37,45.56 28.91,45.56 C17.1 | IC4.12 34.59,42.25 34.69,42.15 | C16.1 35.08,41.75 34.69,42.15 | v34.93,42.39 34.69,42.15 | v30,46.51 30,46.2 29.96,46.15
  Bottom 0.254: v30,46.51 30,45.72 32.07,43.66 33.66,43.66 v34.93,42.39
N$14
  Top 0.203: IC2.6 18.91,21.45 18.57,21.11 18.57,19.93 Q1.1
N$15
  Top 0.254: IC4.1 30.98,46.65 30.32,47.31 28.91,47.31 C18.1
N$16
  Top 0.152: IC4.4 30.39,45.15 30,44.77 30,42.39 29.69,42.07 29.69,41.41 Q2.3
N$17
  Top 0.152: IC4.6 31.34,42.01 31.43,41.91 31.43,40.32 31.11,40.01 30.78,40.01 Q2.1
N$18
  Top 0.254: IC4.22 IM1.1
N$19
  Top 0.254: IM1.2 UFL1.1
N$20
  Top 0.254: IM2.2 UFL2.1
N$21
  Top 0.203: IC3.9 14.54,16.12 14.61,16.19 14.75,16.19 R6.2
OLED_I2C3_SCL  (via drill 0.33)
  Top 0.203: v27.15,30.64 27.62,31.11 29.69,31.11 30.32,31.75 PH-OLED.2 31.43,31.75 32.07,32.38 32.07,33.5 31.75,33.81 31.75,35.56 31.1,36.21 R8.1 | IC2.42 19.41,33.93 21.75,31.59 21.75,31.43 v22.54,30.64
  Bottom 0.203: v27.15,30.64 v22.54,30.64
OLED_I2C3_SDA  (via drill 0.33)
  Top 0.152: 31.11,34.59 R7.1
  Top 0.203: IC2.41 19.91,34.06 22.38,31.59 v22.54,31.59 | v27.15,31.59 29.37,31.59 30.8,33.02 PH-OLED.1 31.11,34.59
  Bottom 0.203: v22.54,31.59 v27.15,31.59
POS_1  (via drill 0.33)
  Top 0.152: v21.75,25.56 21.27,25.56 20.16,24.45 18.26,24.45 17.91,24.1 IC2.4
  Bottom 0.152: v21.75,25.56 22.07,25.56 23.34,24.29 25.24,24.29 26.51,23.02 30.32,23.02 33.34,25.88 33.34,26.67 PH-5POS.P$5
POS_2  (via drill 0.33)
  Top 0.152: v21.75,26.51 20,24.77 18.02,24.77 17.41,24.16 IC2.3
  Bottom 0.152: PH-5POS.P$4 33.66,28.26 33.66,27.62 33.02,26.99 33.02,26.04 30.16,23.34 26.67,23.34 25.4,24.61 23.49,24.61 22.54,25.56 22.54,25.72 v21.75,26.51
POS_3  (via drill 0.33)
  Top 0.152: IC2.13 22.41,24.32 23.34,25.24 v23.81,25.24
  Bottom 0.152: PH-5POS.P$3 33.34,29.21 33.34,27.94 32.7,27.3 32.7,26.19 30,23.65 26.83,23.65 25.24,25.24 v23.81,25.24
POS_4  (via drill 0.33)
  Top 0.152: IC2.12 21.91,24.29 23.18,25.56 v23.18,25.88
  Bottom 0.152: v23.18,25.88 25.08,25.88 26.99,23.97 29.84,23.97 32.39,26.35 32.39,27.62 33.02,28.26 33.02,30.16 PH-5POS.P$2
POS_5  (via drill 0.33)
  Top 0.152: IC2.9 20.41,24.22 20.95,24.77 21.91,24.77 22.54,25.4 22.54,26.19 v23.18,26.83
  Bottom 0.152: PH-5POS.P$1 32.7,31.11 32.7,28.57 32.07,27.94 32.07,26.51 29.69,24.29 27.15,24.29 24.61,26.83 v23.18,26.83
PPM_UART3_RX
  Top 0.152: IC2.33 23.91,33.91 23.65,33.66 23.65,28.89 24.45,28.1 24.45,25.4 25.08,24.77 26.67,24.77 27.15,24.29 28.73,24.29 30.32,22.7 30.32,20.32 32.86,17.78 32.86,13.49 32.07,12.7 JP1.1
SPI1_CS  (via drill 0.33)
  Top 0.152: IC4.19 35.18,47.4 v36.51,48.74 | IC2.18 26.74,25.96 27.15,25.56 v28.1,25.56
  Bottom 0.152: v36.51,48.74 37.94,47.31 37.94,42.07 29.69,33.81 29.69,26.83 28.42,25.56 v28.1,25.56
SPI1_MISO  (via drill 0.33)
  Top 0.152: IC4.16 36.29,45.65 v36.51,45.88 | IC2.20 27.01,26.96 27.15,26.83 v28.1,26.83
  Bottom 0.152: v28.1,26.83 28.42,26.83 29.05,27.46 29.05,34.13 36.99,42.07 36.99,45.4 v36.51,45.88
SPI1_MOSI  (via drill 0.33)
  Top 0.152: IC4.17 35.83,46.15 v36.51,46.83 | IC2.21 v27.46,27.46
  Bottom 0.152: v27.46,27.46 28.42,27.46 28.73,27.78 28.73,34.29 36.51,42.07 36.51,44.93 35.88,45.56 35.88,46.2 v36.51,46.83
SPI1_SCK  (via drill 0.33)
  Top 0.152: IC4.18 35.38,46.65 v36.51,47.78 | IC2.19 26.88,26.46 27.15,26.19 v27.46,26.19
  Bottom 0.152: v36.51,47.78 37.47,46.83 37.47,42.07 29.37,33.97 29.37,27.15 28.42,26.19 v27.46,26.19
SPI2_CS  (via drill 0.33)
  Top 0.152: IC5.19 25.02,47.4 v26.35,48.74 | IC2.34 23.41,35.79 24.29,36.67 v24.29,37.62
  Bottom 0.152: v26.35,48.74 27.3,47.78 27.3,41.59 24.29,38.58 v24.29,37.62
SPI2_MISO  (via drill 0.33)
  Top 0.152: IC5.16 26.13,45.65 v26.35,45.88 | IC2.36 22.41,36.06 23.02,36.67 v23.02,37.62
  Bottom 0.152: v23.02,37.62 23.02,38.26 26.67,41.91 26.67,45.56 v26.35,45.88
SPI2_MOSI  (via drill 0.33)
  Top 0.152: IC5.17 25.67,46.15 v26.35,46.83 | IC2.37 21.91,36.2 22.38,36.67 v22.38,36.99
  Bottom 0.152: v22.38,36.99 22.38,38.1 26.35,42.07 26.35,44.93 25.72,45.56 25.72,46.2 v26.35,46.83
SPI2_SCK  (via drill 0.33)
  Top 0.152: IC5.18 25.22,46.65 v26.35,47.78 | IC2.35 22.91,35.93 23.65,36.67 v23.65,36.99
  Bottom 0.152: v26.35,47.78 26.99,47.15 26.99,41.75 23.65,38.42 v23.65,36.99
SPORT_UART2_RX
  Top 0.152: IC2.17 26.53,25.46 27.23,24.77 28.89,24.77 30.8,22.86 30.8,20.48 33.5,17.78 33.5,17.02 D1.C
  Top 0.203: JP1.5 33.5,1.91 34.45,2.86 34.45,12.54 33.5,13.49 33.5,14.75 R5.2 33.51,16.55 D1.C
SWCLK  (via drill 0.33)
  Top 0.152: IC2.50 13.41,32.46 v13.18,32.23
  Bottom 0.152: v13.18,32.23 12.22,32.23 7.3,27.3 PH-SWD.2
SWDIO  (via drill 0.33)
  Top 0.152: IC2.49 12.92,32.96 v12.86,33.02
  Bottom 0.152: v12.86,33.02 12.38,33.02 9.21,29.84 PH-SWD.4
SX1_BUSY  (via drill 0.33)
  Top 0.152: IC4.7 32.09,42.41 v32.07,42.39 | IC2.23 27.19,28.46 v27.46,28.73
  Bottom 0.152: v32.07,42.39 32.07,40.32 28.1,36.35 28.1,29.37 v27.46,28.73
SX1_DIO  (via drill 0.33)
  Top 0.152: IC4.8 32.59,42.82 v33.02,42.39 | IC2.22 27.01,27.96 27.15,28.1 v28.1,28.1
  Bottom 0.152: v33.02,42.39 33.02,40.8 28.42,36.2 28.42,28.42 v28.1,28.1
SX1_RESET  (via drill 0.33)
  Top 0.152: IC4.3 30.25,45.65 29.69,45.09 29.69,43.18 v29.37,42.86 | IC2.24 26.74,28.96 v27.46,29.69
  Bottom 0.152: v27.46,29.69 27.78,30 27.78,37.31 29.37,38.89 v29.37,42.86
SX2_BUSY  (via drill 0.33)
  Top 0.152: IC5.7 21.93,42.41 v21.91,42.39 | IC2.39 20.91,36.79 v21.11,36.99
  Bottom 0.152: v21.11,36.99 21.11,37.94 21.43,38.26 21.43,41.27 21.91,41.75 v21.91,42.39
SX2_DIO  (via drill 0.33)
  Top 0.152: IC5.8 22.43,42.82 v22.86,42.39 | IC2.38 21.41,36.33 21.75,36.67 v21.75,37.62
  Bottom 0.152: v22.86,42.39 22.86,42.23 21.75,41.12 v21.75,37.62
SX2_RESET  (via drill 0.33)
  Top 0.152: IC5.3 20.09,45.65 19.53,45.09 19.53,43.34 v19.05,42.86 | IC2.40 20.41,36.58 20.48,36.67 v20.48,37.62
  Bottom 0.152: v19.05,42.86 19.05,41.59 20.48,40.16 v20.48,37.62
UART2_TX
  Top 0.152: IC2.14 22.91,24.18 23.34,24.61 24.61,24.61 24.92,24.29 26.59,24.29 27.07,23.81 28.57,23.81 29.84,22.54 29.84,20.16 31.59,18.41 31.59,17.12 D1.A
UART5_CTS
  Top 0.152: IC2.58 12.81,28.46 9.84,31.43 9.84,34.92 6.83,37.94 6.83,40.64 6.35,41.12 5.08,41.12 4.13,42.07 4.13,48.58 PH-SERIAL.2
UART5_RTS_DE
  Top 0.152: IC2.57 12.95,28.96 10.32,31.59 10.32,35.08 7.14,38.26 7.14,40.8 6.51,41.43 5.24,41.43 4.6,42.07 4.6,46.51 PH-SERIAL.3
UART5_RX
  Top 0.152: PH-SERIAL.5 6.03,42.55 7.46,41.12 7.46,38.58 10.79,35.24 10.79,31.75 12.59,29.96 IC2.55
UART5_TX
  Top 0.152: PH-SERIAL.4 5.71,44.45 6.99,43.18 6.99,42.23 7.78,41.43 7.78,38.89 11.27,35.4 11.27,31.91 12.72,30.46 IC2.54
USB_UART1_RX  (via drill 0.33)
  Top 0.203: IC3.18 9.12,16.12 8.26,16.99 8.26,20.64 v12.22,24.61 | IC2.44 18.41,33.81 17.14,32.54 17.14,29.53 v16.99,29.37
  Bottom 0.203: v12.22,24.61 12.54,24.61 16.03,28.1 16.03,28.42 v16.99,29.37
USB_UART1_TX  (via drill 0.33)
  Top 0.203: IC2.43 18.91,33.67 17.62,32.38 17.62,29.05 v16.99,28.42 | v12.22,23.65 11.91,23.65 8.73,20.48 8.73,17.14 9.25,16.62 IC3.17
  Bottom 0.203: v16.99,28.42 v12.22,23.65
VCC
  Top 0.813: 26.04,16.35 24.76,15.08 24.76,12.06 27.62,9.21 C1.+ 28.19,6.99 | C24.1 26.04,16.35 | POLOLU-D24V10F5.1 26.19,16.51 26.04,16.35
  Top 1.016: JP1.3 28.19,6.99
VUSB
  Top 0.203: IC3.8 13.82,15.62 13.89,15.56 | 16.49,14.61 C3.1 16.18,14.92 | C2.1 16.29,16.31 | IC3.7 13.54,15.12 13.97,15.56
  Top 0.254: USB.VBUS 16.49,4.31 15.72,5.08 15.72,6.51 17.14,7.94 17.14,13.96 16.49,14.61 | 13.89,15.56 13.97,15.56 15.54,15.56 | 16.18,14.92 15.54,15.56 | 16.29,16.31 15.54,15.56

### Text on the board
tNames: DBG | 5V | CTS | RTS | Tx | Rx | GND | SER | ESP | SDA | SWD | SCL | 3.3V | GND | (c) www.olliw.eu | mLRS Tx Module | OLED | GND | 5POS | v0.14 / rev00 | PPM | BOOT | BUT | HB | BAT | GND | S.P
bNames: Pololu D24V10F5 | Vin | GND | Vout